# Altium schematic sheet uv.SchDoc: UV Sensor
size A4; CheckedBy: rrodrigu; Author: Satxo; CompanyName: Satxo; Revision: 0v1; SheetNumber: 7; SheetTotal: 8; ProjectName: Basestation
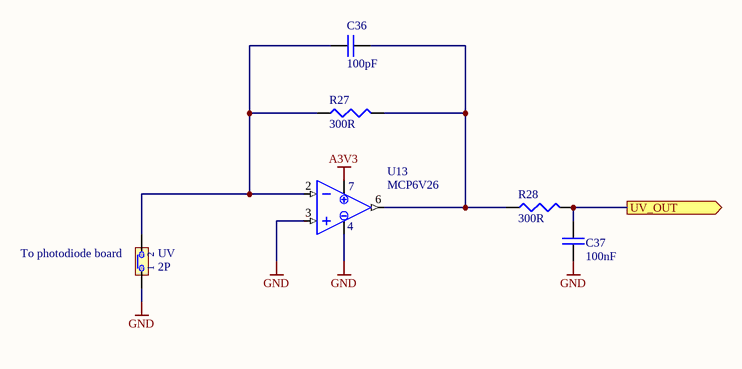
[diagram p0: uv.SchDoc]

## Parts
C36  100pF  [0603]
C37  100nF  [0603]
R27  300R  [0603]
R28  300R  [0603]
U13  MCP6V26  [SOIC-8]
UV  2P  [SIP-2]

## Ports
UV_OUT (out)

## Nets
A3V3: U13.7(VDD)
GND: C37.1 U13.3(INP) U13.4(VSS) UV.1
UV_OUT: C37.2 R28.2 ; port UV_OUT
NetC36_1: C36.1 R27.1 U13.2(INN) UV.2
NetC36_2: C36.2 R27.2 R28.1 U13.6(VOUT)

## Notes on the sheet
- (near UV) To photodiode board
- Title
- Size:
- Date:
- A4
- Number:
- Time:
- Revision:
- Sheet
- of
- File:

## Library data of the parts
C36 C37 = CAP: Capacitor; Owner: Nuno Brum; Sub-Type: Ceramic; Assembly: INS; Maximum Voltage: *; Creation Date: 2005-04-28; Status: Valid; Validation date: 2006-05-15; Type: Capacitor
R27 R28 = RES: Resistor; Owner: Nuno Brum; Sub-Type: Generic; Assembly: INS; Validation date: 2006-05-15; Creation Date: 2002-07-17; Status: Valid; Power: *; Type: Resistor
U13 = MCP6V26: Low-Offset Opamp; Type: IC; Creation Date: 2012-03-15
UV = JMP2: 2-pin Jumper; Owner: Nuno Brum; Sub-Type: Connector; STATE1: 1; Assembly: INS; Validation Date: 2006-05-15; Creation Date: 2002-07-17; Status: Valid; Type: Electrical & Mechanical